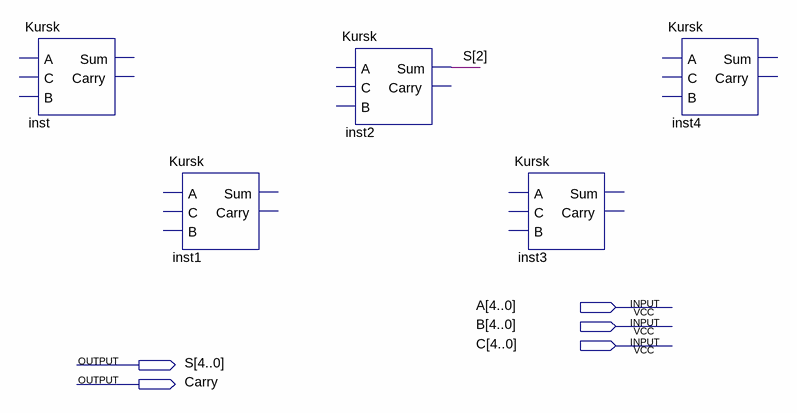
[diagram p0: schematic sheet]
// Quartus schematic Block2.bdf as structural Verilog: 5 symbols, 5 pins
module Block2 (
  input  [4:0] A,
  input  [4:0] B,
  input  [4:0] C,
  output [4:0] S,
  output Carry
);

  Kursk inst ();  // open: A, C, B, Sum, Carry
  Kursk inst1 ();  // open: A, C, B, Sum, Carry
  Kursk inst2 (.Sum(S[2]));  // open: A, C, B, Carry
  Kursk inst3 ();  // open: A, C, B, Sum, Carry
  Kursk inst4 ();  // open: A, C, B, Sum, Carry
endmodule
